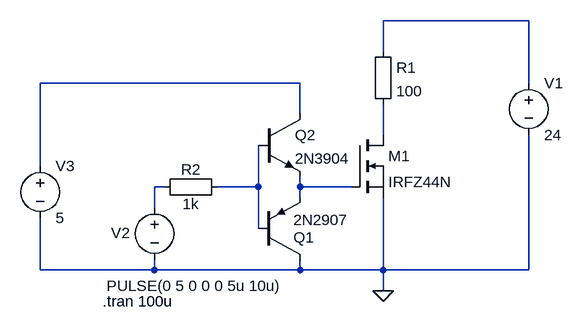
[diagram p0: schematic Drive2.asc]
Drive2.asc, the LTspice schematic file:
Version 4
SHEET 1 880 680
WIRE 320 -96 96 -96
WIRE 96 -48 96 -96
WIRE -32 0 -432 0
WIRE 320 0 320 -96
WIRE -32 48 -32 0
WIRE 96 80 96 32
WIRE -432 128 -432 0
WIRE -240 160 -256 160
WIRE -96 160 -96 96
WIRE -96 160 -160 160
WIRE -32 160 -32 144
WIRE 48 160 -32 160
WIRE -32 176 -32 160
WIRE -256 192 -256 160
WIRE -96 224 -96 160
WIRE -432 288 -432 208
WIRE -256 288 -256 272
WIRE -256 288 -432 288
WIRE -32 288 -32 272
WIRE -32 288 -256 288
WIRE 96 288 96 176
WIRE 96 288 -32 288
WIRE 320 288 320 80
WIRE 320 288 96 288
WIRE 96 320 96 288
FLAG 96 320 0
SYMBOL nmos 48 80 R0
SYMATTR InstName M1
SYMATTR Value IRFZ44N
SYMBOL voltage 320 -16 R0
WINDOW 123 0 0 Left 0
WINDOW 39 0 0 Left 0
SYMATTR InstName V1
SYMATTR Value 24
SYMBOL Misc\\EuropeanResistor 80 -64 R0
SYMATTR InstName R1
SYMATTR Value 100
SYMBOL Misc\\EuropeanResistor -256 176 R270
WINDOW 0 27 56 VTop 2
WINDOW 3 5 56 VBottom 2
SYMATTR InstName R2
SYMATTR Value 1k
SYMBOL voltage -256 176 R0
WINDOW 3 -74 136 Left 2
WINDOW 123 0 0 Left 0
WINDOW 39 0 0 Left 0
WINDOW 0 -67 55 Left 2
SYMATTR Value PULSE(0 5 0 0 0 5u 10u)
SYMATTR InstName V2
SYMBOL pnp -96 272 M180
WINDOW 0 54 34 Left 2
WINDOW 3 54 61 Left 2
SYMATTR InstName Q1
SYMATTR Value 2N2907
SYMBOL npn -96 48 R0
SYMATTR InstName Q2
SYMATTR Value 2N3904
SYMBOL voltage -432 112 R0
WINDOW 123 0 0 Left 0
WINDOW 39 0 0 Left 0
SYMATTR InstName V3
SYMATTR Value 5
TEXT -336 336 Left 2 !.tran 100u

The netlist it stands for:
* Drive2.asc
M1 N003 N006 0 0 IRFZ44N
V1 N001 0 24
R1 N001 N003 100
R2 N004 N005 1k
V2 N004 0 PULSE(0 5 0 0 0 5u 10u)
Q1 0 N005 N006 0 2N2907
Q2 N002 N005 N006 0 2N3904
V3 N002 0 5
.model NPN NPN
.model PNP PNP
.lib standard.bjt
.model NMOS NMOS
.model PMOS PMOS
.lib standard.mos
.tran 100u
.backanno
.end